# Altium schematic sheet MOSFET_BANK.SchDoc
size C; SheetNumber: 2; SheetTotal: 15
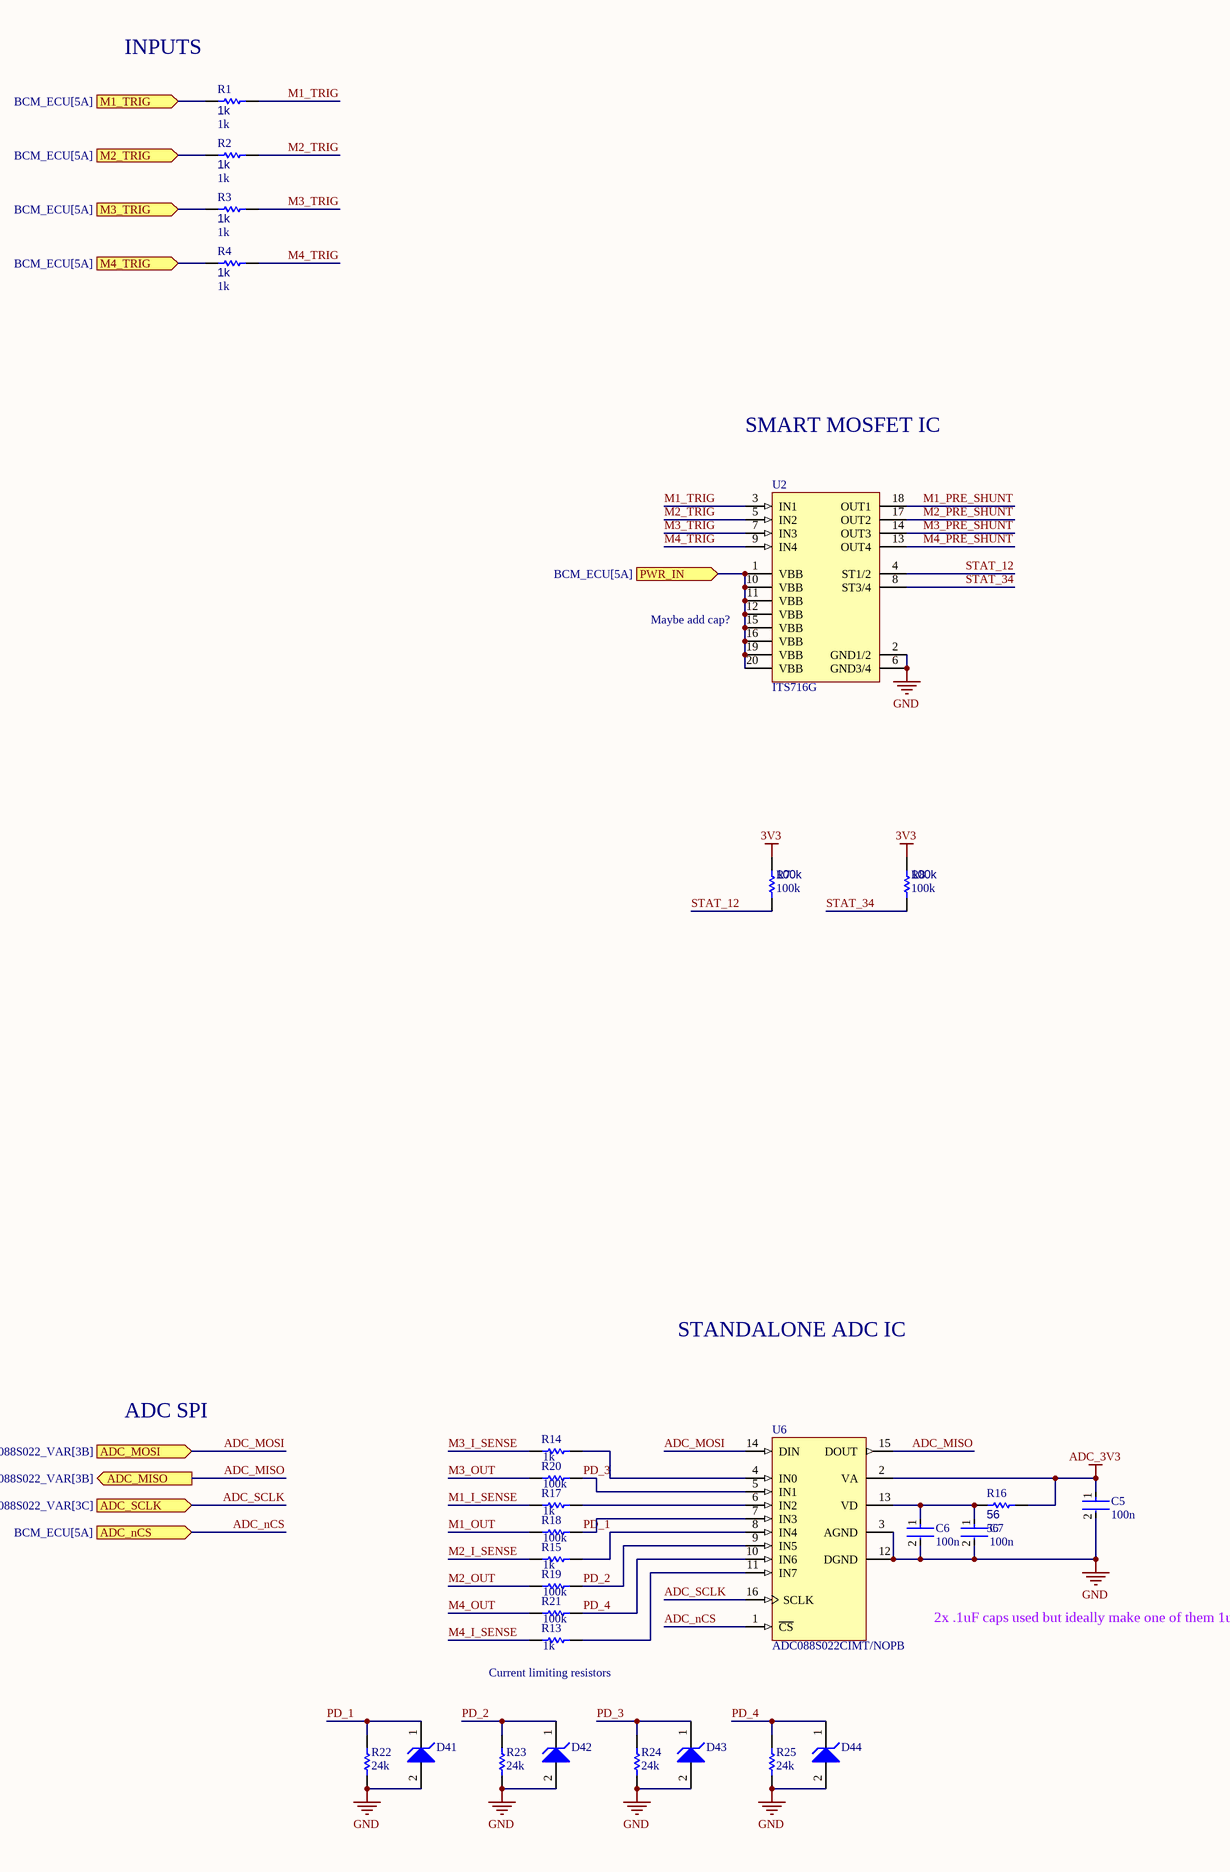
[diagram p0: MOSFET_BANK.SchDoc, left]
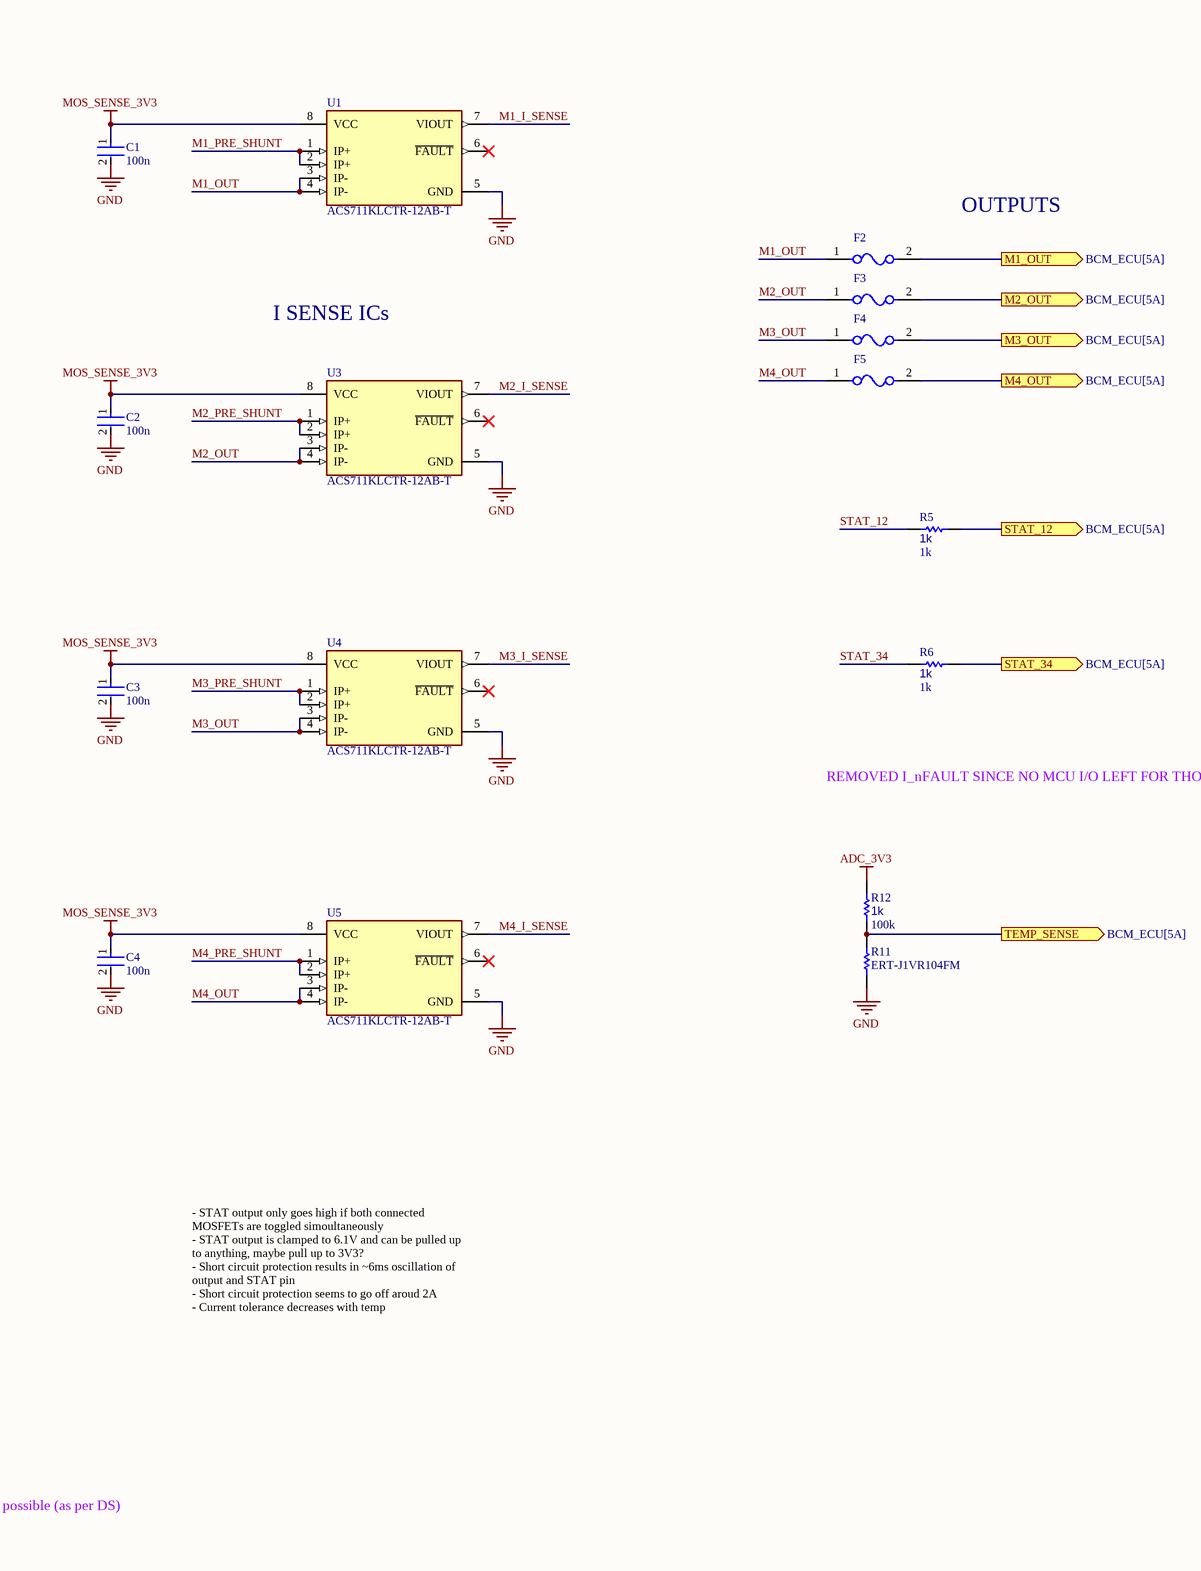
[diagram p1: MOSFET_BANK.SchDoc, right]

## Parts
C1  100n  [FP-0402-L_1_0_0_05-W_0_5-IPC_A]
C2  100n  [FP-0402-L_1_0_0_05-W_0_5-IPC_A]
C3  100n  [FP-0402-L_1_0_0_05-W_0_5-IPC_A]
C4  100n  [FP-0402-L_1_0_0_05-W_0_5-IPC_A]
C5  100n  [FP-0402-L_1_0_0_05-W_0_5-IPC_A]
C6  100n  [FP-0402-L_1_0_0_05-W_0_5-IPC_A]
C7  100n  [FP-0402-L_1_0_0_05-W_0_5-IPC_A]
D41  MM5Z3V3T1G  [ONSC-SOD-523-2-502-01_V]  (value not drawn)
D42  MM5Z3V3T1G  [ONSC-SOD-523-2-502-01_V]  (value not drawn)
D43  MM5Z3V3T1G  [ONSC-SOD-523-2-502-01_V]  (value not drawn)
D44  MM5Z3V3T1G  [ONSC-SOD-523-2-502-01_V]  (value not drawn)
F2  0466003.NR  [FP-0466-MFG]  (value not drawn)
F3  0466003.NR  [FP-0466-MFG]  (value not drawn)
F4  0466003.NR  [FP-0466-MFG]  (value not drawn)
F5  0466003.NR  [FP-0466-MFG]  (value not drawn)
R1  1k  [R0603B]
R2  1k  [R0603B]
R3  1k  [R0603B]
R4  1k  [R0603B]
R5  1k  [R0603B]
R6  1k  [R0603B]
R7  100k  [R0603B]
R8  100k  [R0603B]
R11  ERT-J1VR104FM  [RESC1608X90X30ML15T20]
R12  100k  value 1k  [R0603B]
R13  1k  [R0603B]
R14  1k  [R0603B]
R15  1k  [R0603B]
R16  56  [R0603B]
R17  1k  [R0603B]
R18  100k  [R0603B]
R19  100k  [R0603B]
R20  100k  [R0603B]
R21  100k  [R0603B]
R22  24k  [R0603B]
R23  24k  [R0603B]
R24  24k  [R0603B]
R25  24k  [R0603B]
U1  ACS711KLCTR-12AB-T  [FP-LC-8-IPC_C]
U2  ITS716G  [INF-PG-DSO-20-32_L]
U3  ACS711KLCTR-12AB-T  [FP-LC-8-IPC_C]
U4  ACS711KLCTR-12AB-T  [FP-LC-8-IPC_C]
U5  ACS711KLCTR-12AB-T  [FP-LC-8-IPC_C]
U6  ADC088S022CIMT/NOPB  [MTC16_L]

## Ports
ADC_MISO (out, see BCM_ECU[5A], ADC088S022[3B], ADC088S022_VAR[3B]), ADC_MOSI (in, see BCM_ECU[5A], ADC088S022[3B], ADC088S022_VAR[3B]), ADC_nCS (in, see BCM_ECU[5A]), ADC_SCLK (in, see BCM_ECU[5A], ADC088S022[3C], ADC088S022_VAR[3C]), M1_OUT (out, see BCM_ECU[5A]), M1_TRIG (in, see BCM_ECU[5A]), M2_OUT (out, see BCM_ECU[5A]), M2_TRIG (in, see BCM_ECU[5A]), M3_OUT (out, see BCM_ECU[5A]), M3_TRIG (in, see BCM_ECU[5A]), M4_OUT (out, see BCM_ECU[5A]), M4_TRIG (in, see BCM_ECU[5A]), PWR_IN (in, see BCM_ECU[5A]), STAT_12 (out, see BCM_ECU[5A]), STAT_34 (out, see BCM_ECU[5A]), TEMP_SENSE (out, see BCM_ECU[5A])

## Nets
3V3: R7.2 R8.2
ADC_3V3: C5.1 R12.1 R16.1 U6.2(VA)
GND: C1.2 C2.2 C3.2 C4.2 C5.2 C6.2 C7.2 D41.2(A) D42.2(A) D43.2(A) D44.2(A) R11.1 R22.2 R23.2 R24.2 R25.2 U1.5(GND) U2.2(GND1/2) U2.6(GND3/4) U3.5(GND) U4.5(GND) U5.5(GND) U6.3(AGND) U6.12(DGND)
MOS_SENSE_3V3: C1.1 C2.1 C3.1 C4.1 U1.8(VCC) U3.8(VCC) U4.8(VCC) U5.8(VCC)
ADC_MISO: U6.15(DOUT) ; port ADC_MISO
ADC_MOSI: U6.14(DIN) ; port ADC_MOSI
ADC_nCS: U6.1(~{CS}) ; port ADC_nCS
ADC_SCLK: U6.16(SCLK) ; port ADC_SCLK
M1_I_SENSE: R17.2 U1.7(VIOUT)
M1_OUT: F2.1 R18.2 U1.3(IP-) U1.4(IP-)
M1_OUT: F2.2 ; port M1_OUT  [a separate net that carries the same name]
M1_PRE_SHUNT: U1.1(IP+) U1.2(IP+) U2.18(OUT1)
M1_TRIG: R1.2 U2.3(IN1)
M1_TRIG: R1.1 ; port M1_TRIG  [a separate net that carries the same name]
M2_I_SENSE: R15.2 U3.7(VIOUT)
M2_OUT: F3.1 R19.2 U3.3(IP-) U3.4(IP-)
M2_OUT: F3.2 ; port M2_OUT  [a separate net that carries the same name]
M2_PRE_SHUNT: U2.17(OUT2) U3.1(IP+) U3.2(IP+)
M2_TRIG: R2.2 U2.5(IN2)
M2_TRIG: R2.1 ; port M2_TRIG  [a separate net that carries the same name]
M3_I_SENSE: R14.2 U4.7(VIOUT)
M3_OUT: F4.1 R20.2 U4.3(IP-) U4.4(IP-)
M3_OUT: F4.2 ; port M3_OUT  [a separate net that carries the same name]
M3_PRE_SHUNT: U2.14(OUT3) U4.1(IP+) U4.2(IP+)
M3_TRIG: R3.2 U2.7(IN3)
M3_TRIG: R3.1 ; port M3_TRIG  [a separate net that carries the same name]
M4_I_SENSE: R13.2 U5.7(VIOUT)
M4_OUT: F5.1 R21.2 U5.3(IP-) U5.4(IP-)
M4_OUT: F5.2 ; port M4_OUT  [a separate net that carries the same name]
M4_PRE_SHUNT: U2.13(OUT4) U5.1(IP+) U5.2(IP+)
M4_TRIG: R4.2 U2.9(IN4)
M4_TRIG: R4.1 ; port M4_TRIG  [a separate net that carries the same name]
PD_1: D41.1(K) R18.1 R22.1 U6.7(IN3)
PD_2: D42.1(K) R19.1 R23.1 U6.9(IN5)
PD_3: D43.1(K) R20.1 R24.1 U6.5(IN1)
PD_4: D44.1(K) R21.1 R25.1 U6.10(IN6)
PWR_IN: U2.1(VBB) U2.10(VBB) U2.11(VBB) U2.12(VBB) U2.15(VBB) U2.16(VBB) U2.19(VBB) U2.20(VBB) ; port PWR_IN
STAT_12: R5.2 R7.1 U2.4(ST1/2)
STAT_12: R5.1 ; port STAT_12  [a separate net that carries the same name]
STAT_34: R6.2 R8.1 U2.8(ST3/4)
STAT_34: R6.1 ; port STAT_34  [a separate net that carries the same name]
TEMP_SENSE: R11.2 R12.2 ; port TEMP_SENSE
NetC6_1: C6.1 C7.1 R16.2 U6.13(VD)
NetR13_1: R13.1 U6.11(IN7)
NetR14_1: R14.1 U6.4(IN0)
NetR15_1: R15.1 U6.8(IN4)
NetR17_1: R17.1 U6.6(IN2)

Not connected (* = marked no-connect by the designer): U1 6(~{FAULT})*; U3 6(~{FAULT})*; U4 6(~{FAULT})*; U5 6(~{FAULT})*

## Notes on the sheet
- (near R1) INPUTS
- OUTPUTS
- SMART MOSFET IC
- I SENSE ICs
- (near U2) Maybe add cap?
- REMOVED I_nFAULT SINCE NO MCU I/O LEFT FOR THOSE SIGNALS
- STANDALONE ADC IC
- ADC SPI
- - STAT output only goes high if both connected MOSFETs are toggled simoultaneously
  - STAT output is clamped to 6.1V and can be pulled up to anything, maybe pull up to 3V3?
  - Short circuit protection results in ~6ms oscillation of output and STAT pin
  - Short circuit protection seems to go off aroud 2A
  - Current tolerance decreases with temp
- (near R13) Current limiting resistors
- 2x .1uF caps used but ideally make one of them 1uF if possible (as per DS)

## Library data of the parts
C1-C7 = CMP-001-00058-1: LARGE PADS, 0402 CAP, CHANGE COMMENT TO MATCH REAL P/N; Capacitor Type: Ceramic; Min Operating Temperature: -55°C; Mounting Technology: Surface Mount; Pins: 2; Case/Package: 0402; RoHS Compliant: Yes; Max Operating Temperature: 85°C
D41-D44 = CMP-1060-00750-1: Zener Voltage Regulator, 500 mW, 2-Pin SOD-523, Pb-Free, Tape and Reel; Manufacturer: On Semiconductor; P Max (W): 0.5; VZ Typ (V): 3.3; RoHS: Pb-Free; ComponentLink2Description: Datasheet; PackageReference: SOD-523-2-502-01; DatasheetVersion: Rev. 10; ComponentLink1Description: Manufacturer URL; PackageVersion: Rev. E, 09/2010; ComponentLink3URL: http://www.onsemi.com/pub_link/Collateral/502-01.PDF; ComponentLink2URL: http://www.onsemi.cn/pub_link/Collateral/MM5Z2V4T1-D.PDF; Mounting Technology: Surface Mount; PartNumber: MM5Z3V3T1G; Packing: Tape and Reel; PackageDescription: 2-Pin SOD, Body 1.2 x 0.8 mm; ComponentLink1URL: http://www.onsemi.com/; ComponentLink3Description: Package Specification
F2-F5 = CMP-08605-000054-1: FUSE BOARD MNT 3A 32VAC/VDC 1206; Manufacturer: Littelfuse; Fuse Interrupt Ac Current: 50A; Fuse Voltage Drop: 75.99mV; Max Fuse Ac Voltage: 32V; Fuse I2T: 0.576A2Sec; Resistance: 0.019Ω; Fuse Blow Speed: Fast; Value: 0.019Ω; ComponentLink2Description: Datasheet; Fuse Current: 3A; RoHS: TRUE; Mouser Description: Surface Mount Fuses 32V 3A VFA Slimline; Height: 0.66mm; Octopart: https://octopart.com/0466003.nr-littelfuse-565175; Package: 0466; Fuse Interrupt Dc Current: 50A; Manufacturer Part Number: 0466003.NR; Temperature Range Low: -55°C; ComponentLink2URL: https://www.littelfuse.com/~/media/electronics/datasheets/fuses/littelfuse_fuse_466_datasheet.pdf.pdf; Digikey Description: FUSE BOARD MNT 3A 32VAC/VDC 1206; Voltage Rating: 32V; Category: Fuse; Lead Free: Yes; Device Class L2: Fuses; Automotive: No; Max Fuse Dc Voltage: 32V; Temperature Range High: +90°C; Device Class L3: unset; Device Class L1: Circuit Protection; Temperature: -55°C to +90°C
R1-R8 R12-R17 = CMP-009-00002-14: Resistor
  R1-R6 R13-R15 R17: Value: 1k
  R7 R8: Value: 100k
  R16: Value: 56
R11 = CMP-2000-00869-1: Part Number: ERT-J1VR103J; Manufacturer: Panasonic
R18-R21 = CMP-009-00002-14: Resistor; Value: 10k
R22-R25 = CMP-009-00002-14: Resistor; Value: 2.7k
U1 U3-U5 = CMP-1557-00012-2: SENSOR CURRENT HALL 12.5A AC/DC; Number of Channels: 1; Min Supply Voltage: 3V; Sensitivity: 110mV/A; Response Time: 4.6us; Operating Supply Voltage: 3.3V; Max Supply Voltage: 5.5V; Max Supply Current: 5.5mA; Bandwidth: 100kHz; Linearity: 1%; Quiescent Current: 4mA; Accuracy: 5%; Polarity: Bidirectional; Case/Package: SOIC; Packaging: Tape and Reel; Number of Pins: 8; Width: 3.9mm; Frequency: 100kHz; -3db Bandwidth: 100kHz; REACH SVHC: No SVHC; Series: -; Height: 1.5mm; Package Quantity: 1; Min Operating Temperature: -40°C; Max Operating Temperature: 125°C; Current Sensing: 12.5A; RoHS Compliant: Yes; Length: 4.9mm
U2 = CMP-1095-00041-1: Smart High-Side Power Switch for Industrial Applications 4 Channels: 4 x 140 mOhm Status Feedback, 5.5 to 40 V Operating, -30 to 85 degC, PG-DSO-20-32, Reel, Green; Manufacturer: Infineon; Green: TRUE; Operating Voltage Range (max): 40 V; Operating Voltage Range (min): 5.5Â V; Ptot (max): 3.6Â W; Diagnostic: Digital; IL (nom)min - one channel active: 2.3Â A; RON (max) @ Tj max: 280 mOhm; RON @ 25 degC: 140 mOhm (max); IL (SC): 9 A; IL (nom)min - all channels active: 1.3Â A; toff (max): 270 us; Channels: 4; ton (max): 250 us; ComponentLink1Description: Manufacturer URL; Packing: Reel; ComponentLink3Description: Package Specification; ComponentLink1URL: http://www.infineon.com/; Halogen-free: available; Mounting Technology: Surface Mount; PartNumber: ITS716G; ComponentLink3URL: http://www.infineon.com/dgdl/BTS+4130QGA_DS10+_neu.pdf?folderId=db3a304314dca389011537739e37155f&fileId=db3a30431a5c32f2011a957932285680&sId=db3a30433d68e984013d7f42d6576278; PackageVersion: Mar-08; ComponentLink2Description: Datasheet; ComponentLink2URL: http://www.infineon.com/dgdl/ITS716G_DS11_20081002.pdf?folderId=db3a304412b407950112b408e8c90004&fileId=db3a304412b407950112b428c2cf3e6d; DatasheetVersion: Rev. 1.1; PackageDescription: 20-Pin Plastic (Green) Dual Small Outline Package, 12.7 x 7.5 mm Body, 1.27 mm Pitch; Load Current (typ): 1.3Â A; PackageReference: PG-DSO-20-32; IL (SCp): 9 A
U6 = CMP-0054-00372-2: 8-Channel, 50 kSPS to 200 kSPS, 8-Bit A/D Converter, 16-pin TSSOP, Pb-Free; Manufacturer: National Semiconductor; PackageTopMarking: NSUZXYTT*88S022*CIMT; CompType: ADC IC; PowerWise: Y; ComponentLink2URL: http://www.national.com/pf/AD/ADC088S022.html; RoHS: Y; PackageDescription: Molded TSSOP, Jedec, 5 x 4.4 x 0.9mm Body, 16 Lead, 0.65mm Pitch; DatasheetVersion: Feb-2010; PinCount: 16; ComponentLink1Description: ADC088S022 Datasheet; Code_JEDEC: MO-153-AB; ComponentLink3URL: http://www.national.com/packaging/folders/mtc16.html; PackageVersion: revD, Jun-2003; ComponentLink3Description: MTC16 Package Page; RevisionNote: Component URLs added; ComponentLink1URL: http://www.national.com/ds/AD/ADC088S022.pdf; ComponentLink2Description: ADC088S022 Web Page; PackageReference: MTC16